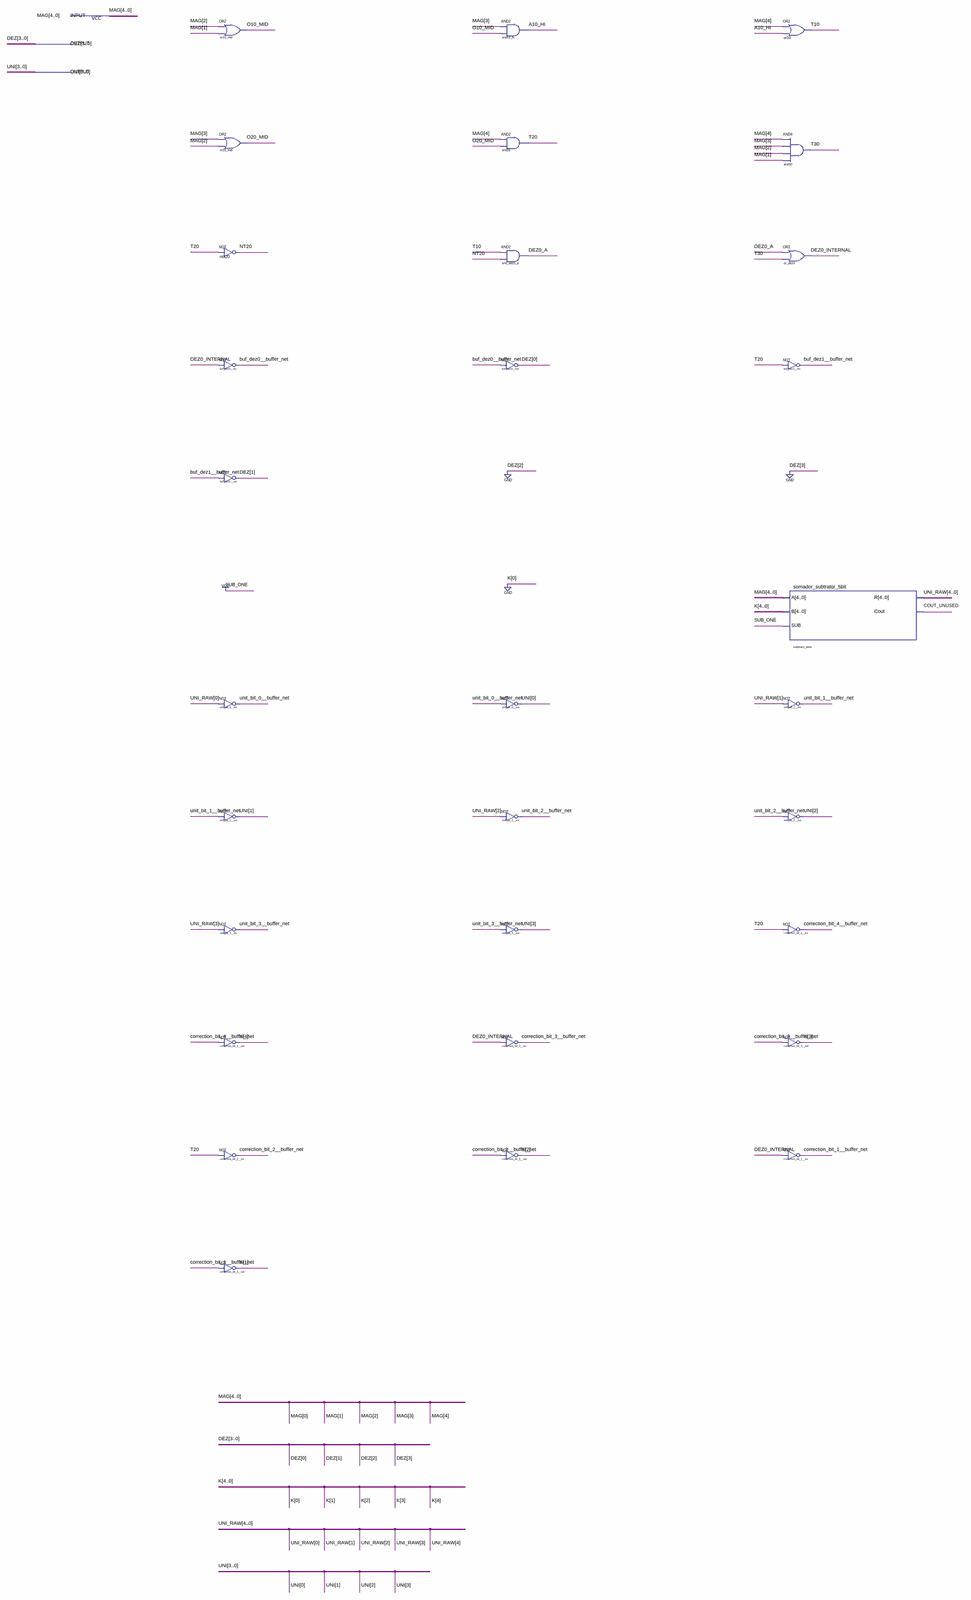
[diagram p0: schematic sheet, whole]
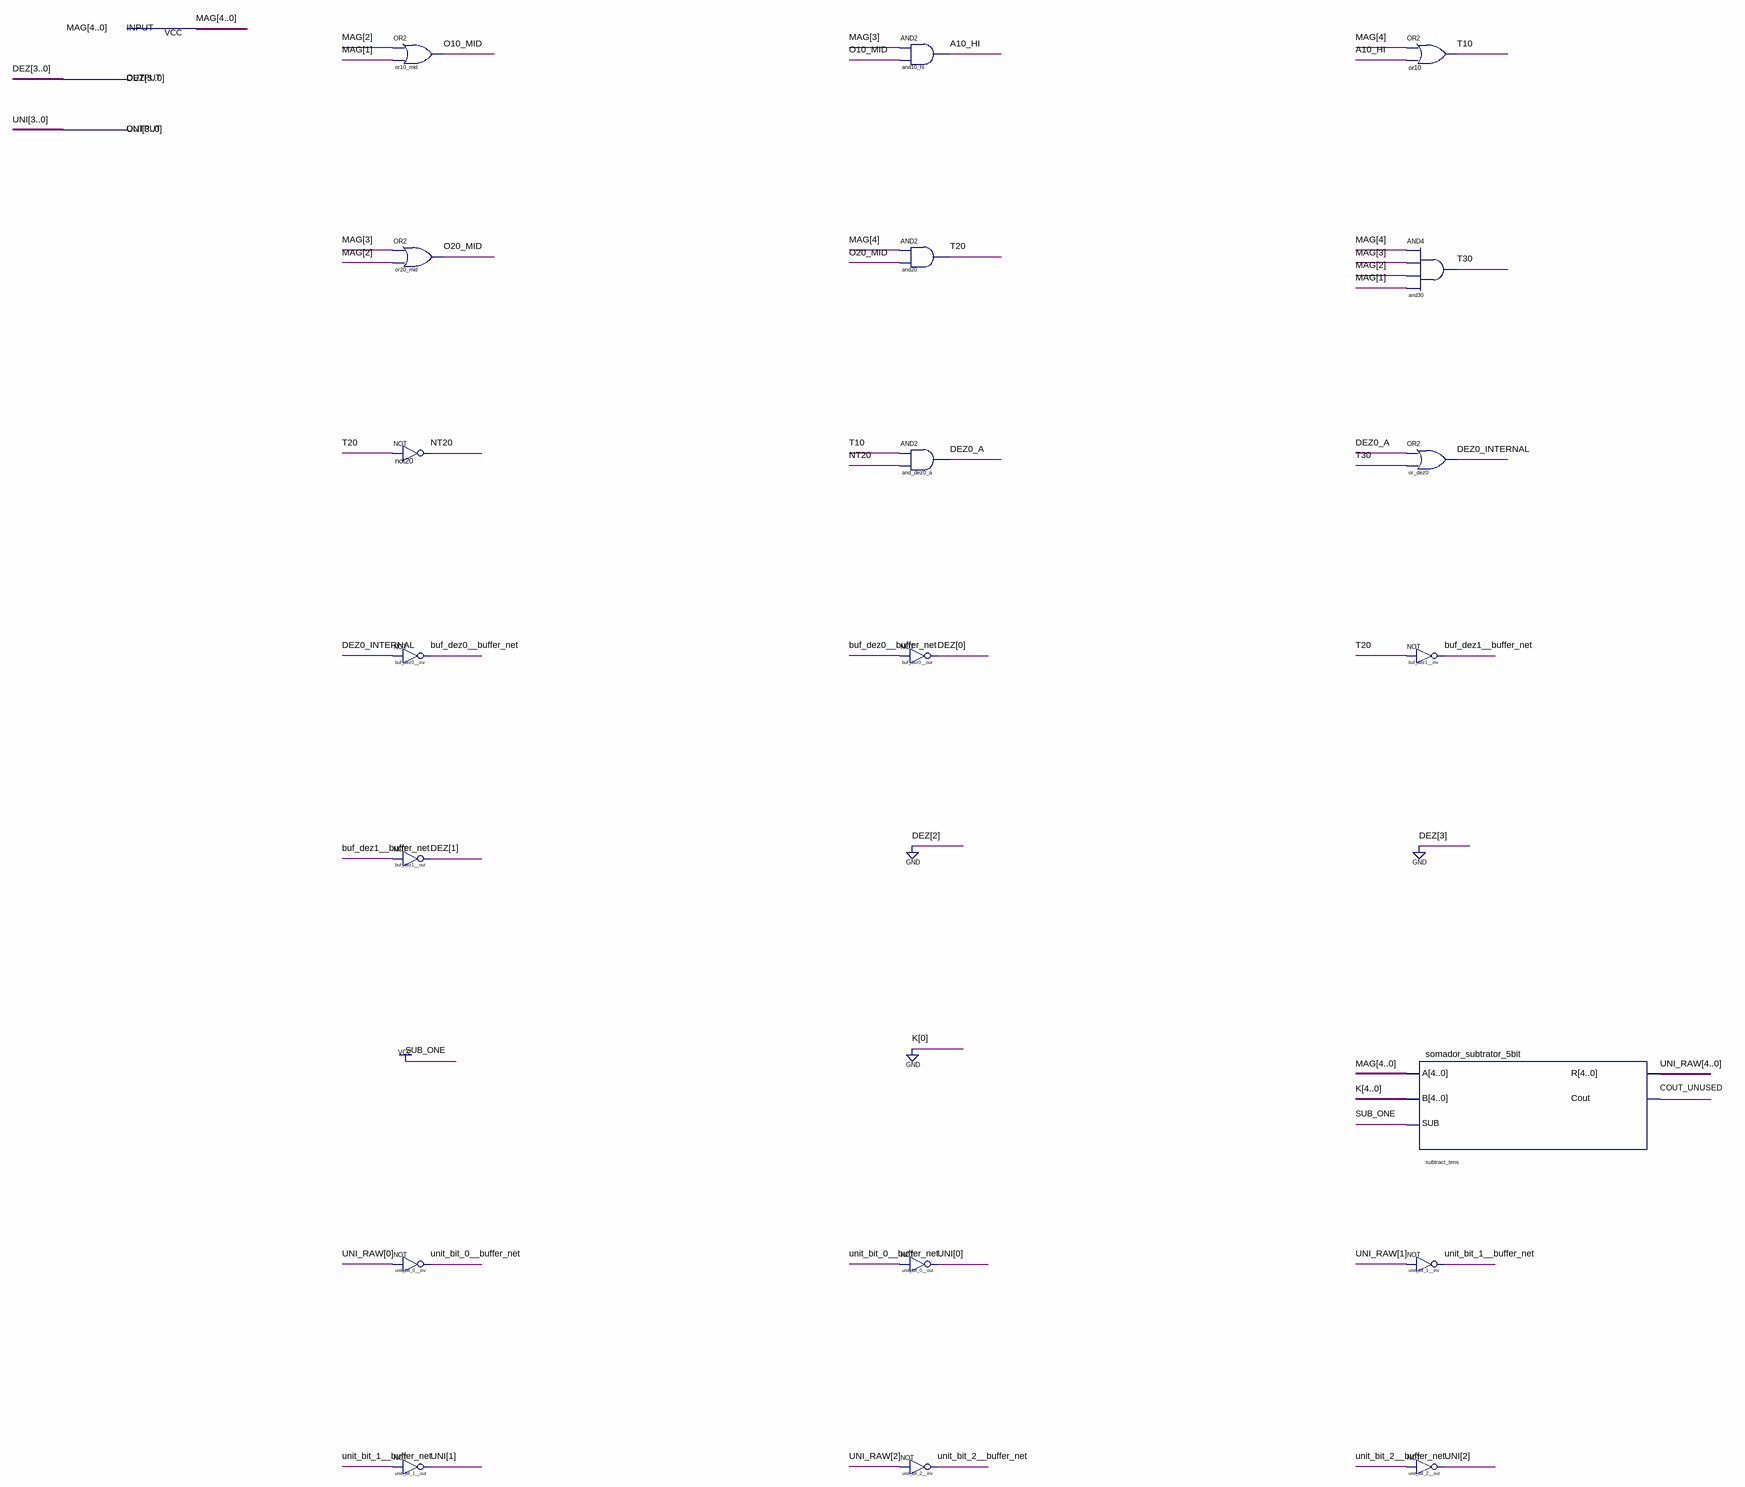
[diagram p1: schematic sheet, upper part]
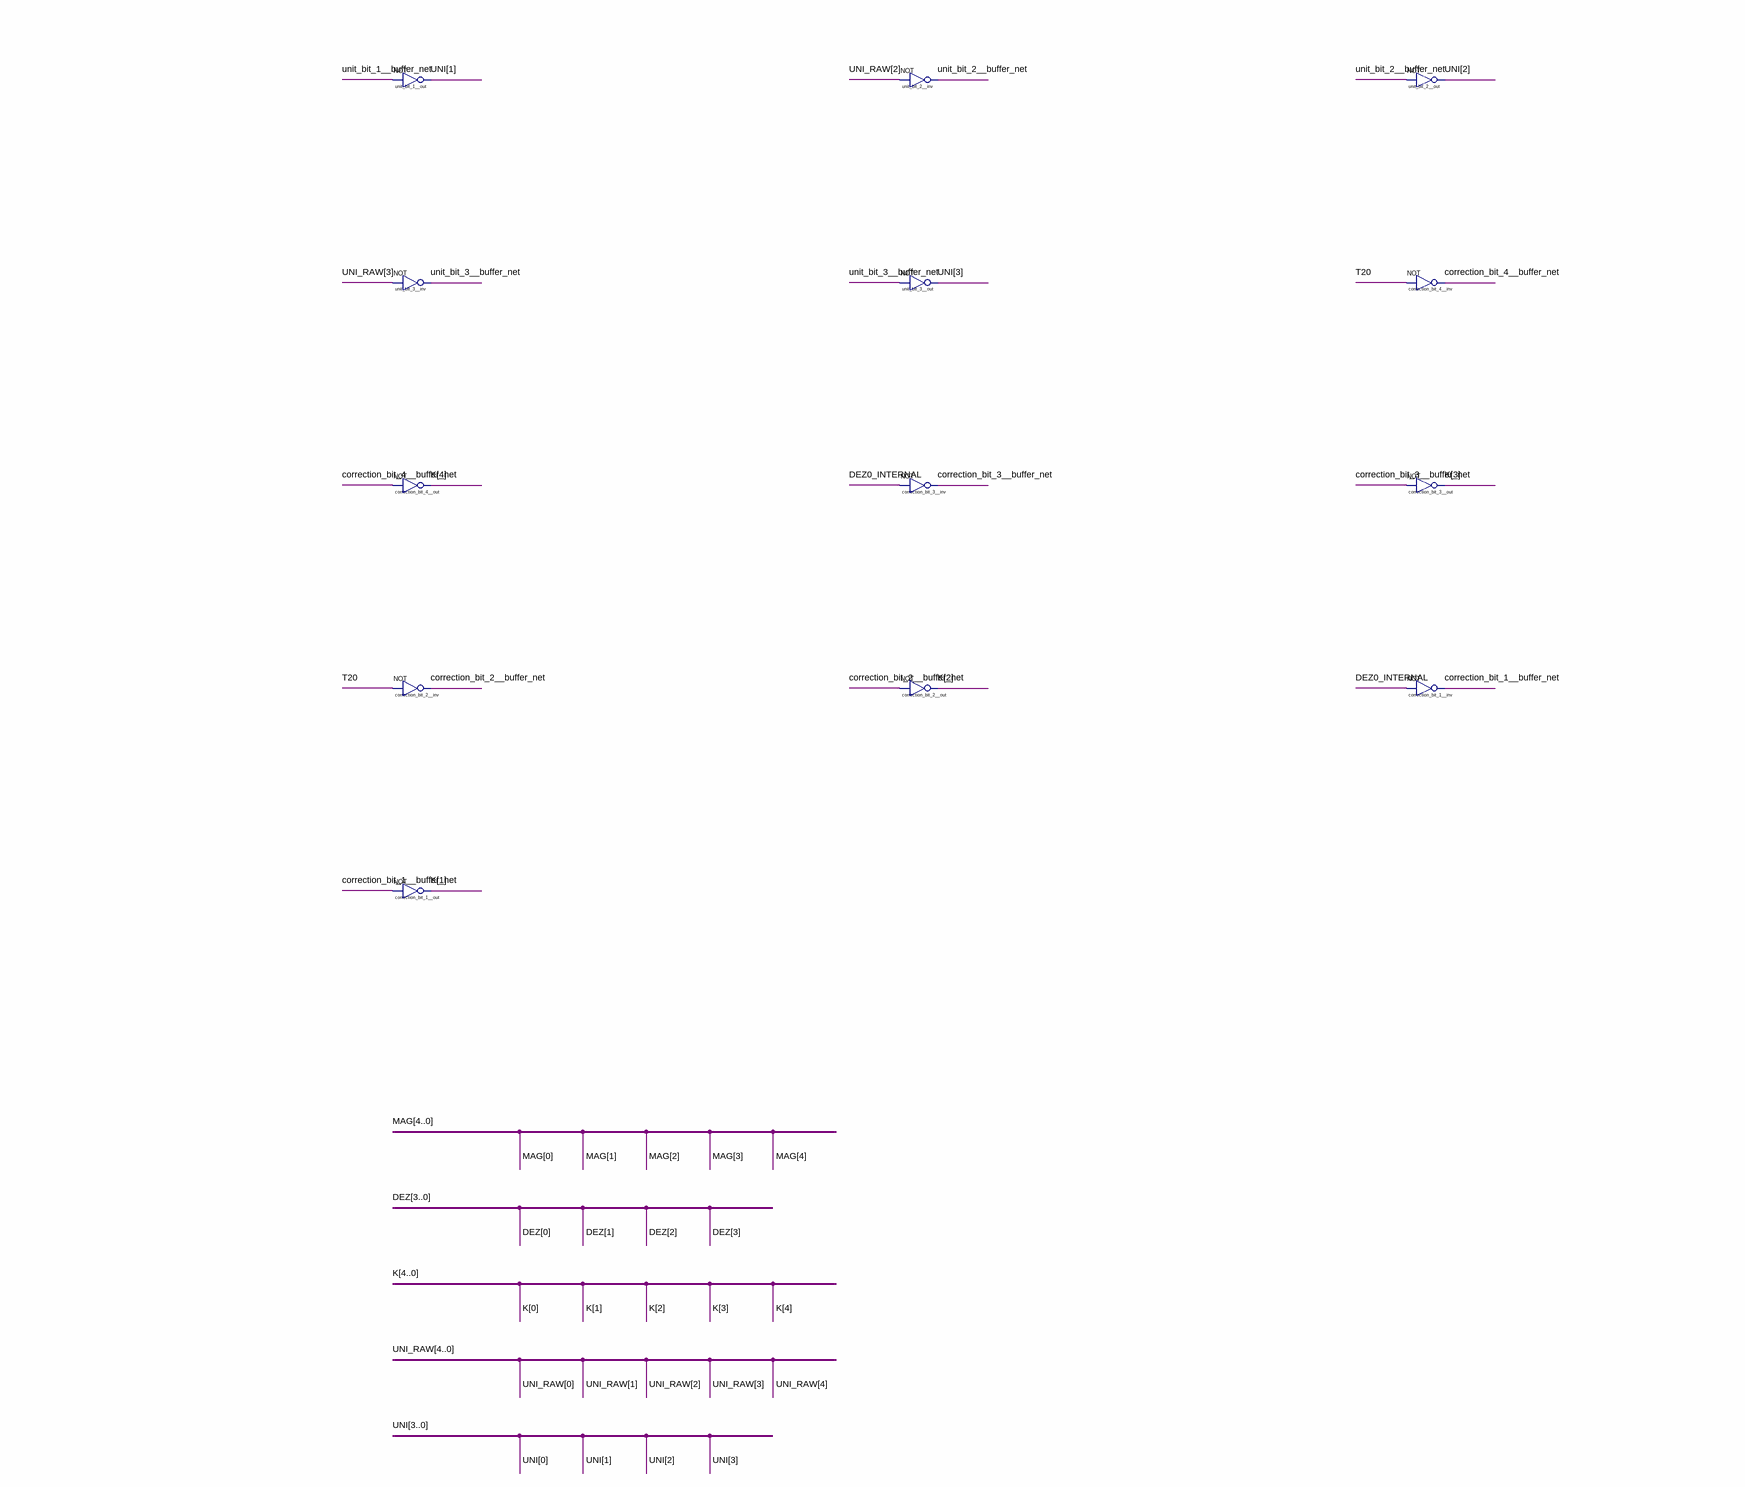
[diagram p2: schematic sheet, lower part]
// Quartus schematic bin_bcd.bdf as structural Verilog: 30 symbols, 3 pins
module bin_bcd (
  input  [4:0] MAG,
  output [3:0] DEZ,
  output [3:0] UNI
);

  wire A10_HI, buf_dez0__buffer_net, buf_dez1__buffer_net, correction_bit_1__buffer_net,
       correction_bit_2__buffer_net, correction_bit_3__buffer_net, correction_bit_4__buffer_net, COUT_UNUSED,
       DEZ0_A, DEZ0_INTERNAL, NT20, O10_MID, O20_MID, T10, T20, T30, unit_bit_0__buffer_net,
       unit_bit_1__buffer_net, unit_bit_2__buffer_net, unit_bit_3__buffer_net;
  wire [4:0] UNI_RAW;
  wire [4:1] K;

  or or10_mid (O10_MID, MAG[2], MAG[1]);
  or or20_mid (O20_MID, MAG[3], MAG[2]);
  not not20 (NT20, T20);
  not buf_dez0__inv (buf_dez0__buffer_net, DEZ0_INTERNAL);
  not buf_dez1__out (DEZ[1], buf_dez1__buffer_net);
  not unit_bit_0__inv (unit_bit_0__buffer_net, UNI_RAW[0]);
  not unit_bit_1__out (UNI[1], unit_bit_1__buffer_net);
  not unit_bit_3__inv (unit_bit_3__buffer_net, UNI_RAW[3]);
  not correction_bit_4__out (K[4], correction_bit_4__buffer_net);
  not correction_bit_2__inv (correction_bit_2__buffer_net, T20);
  not correction_bit_1__out (K[1], correction_bit_1__buffer_net);
  and and10_hi (A10_HI, MAG[3], O10_MID);
  and and20 (T20, MAG[4], O20_MID);
  and and_dez0_a (DEZ0_A, T10, NT20);
  not buf_dez0__out (DEZ[0], buf_dez0__buffer_net);
  not unit_bit_0__out (UNI[0], unit_bit_0__buffer_net);
  not unit_bit_2__inv (unit_bit_2__buffer_net, UNI_RAW[2]);
  not unit_bit_3__out (UNI[3], unit_bit_3__buffer_net);
  not correction_bit_3__inv (correction_bit_3__buffer_net, DEZ0_INTERNAL);
  not correction_bit_2__out (K[2], correction_bit_2__buffer_net);
  or or10 (T10, MAG[4], A10_HI);
  and and30 (T30, MAG[4], MAG[3], MAG[2], MAG[1]);
  or or_dez0 (DEZ0_INTERNAL, DEZ0_A, T30);
  not buf_dez1__inv (buf_dez1__buffer_net, T20);
  somador_subtrator_5bit subtract_tens (.A(MAG), .B({K, 1'b0}), .SUB(1'b1), .R(UNI_RAW), .Cout(COUT_UNUSED));
  not unit_bit_1__inv (unit_bit_1__buffer_net, UNI_RAW[1]);
  not unit_bit_2__out (UNI[2], unit_bit_2__buffer_net);
  not correction_bit_4__inv (correction_bit_4__buffer_net, T20);
  not correction_bit_3__out (K[3], correction_bit_3__buffer_net);
  not correction_bit_1__inv (correction_bit_1__buffer_net, DEZ0_INTERNAL);

  assign DEZ[3:2] = 2'b00;
endmodule
